# Altium project ESP32_LoRa_Master_Project.PrjPcb
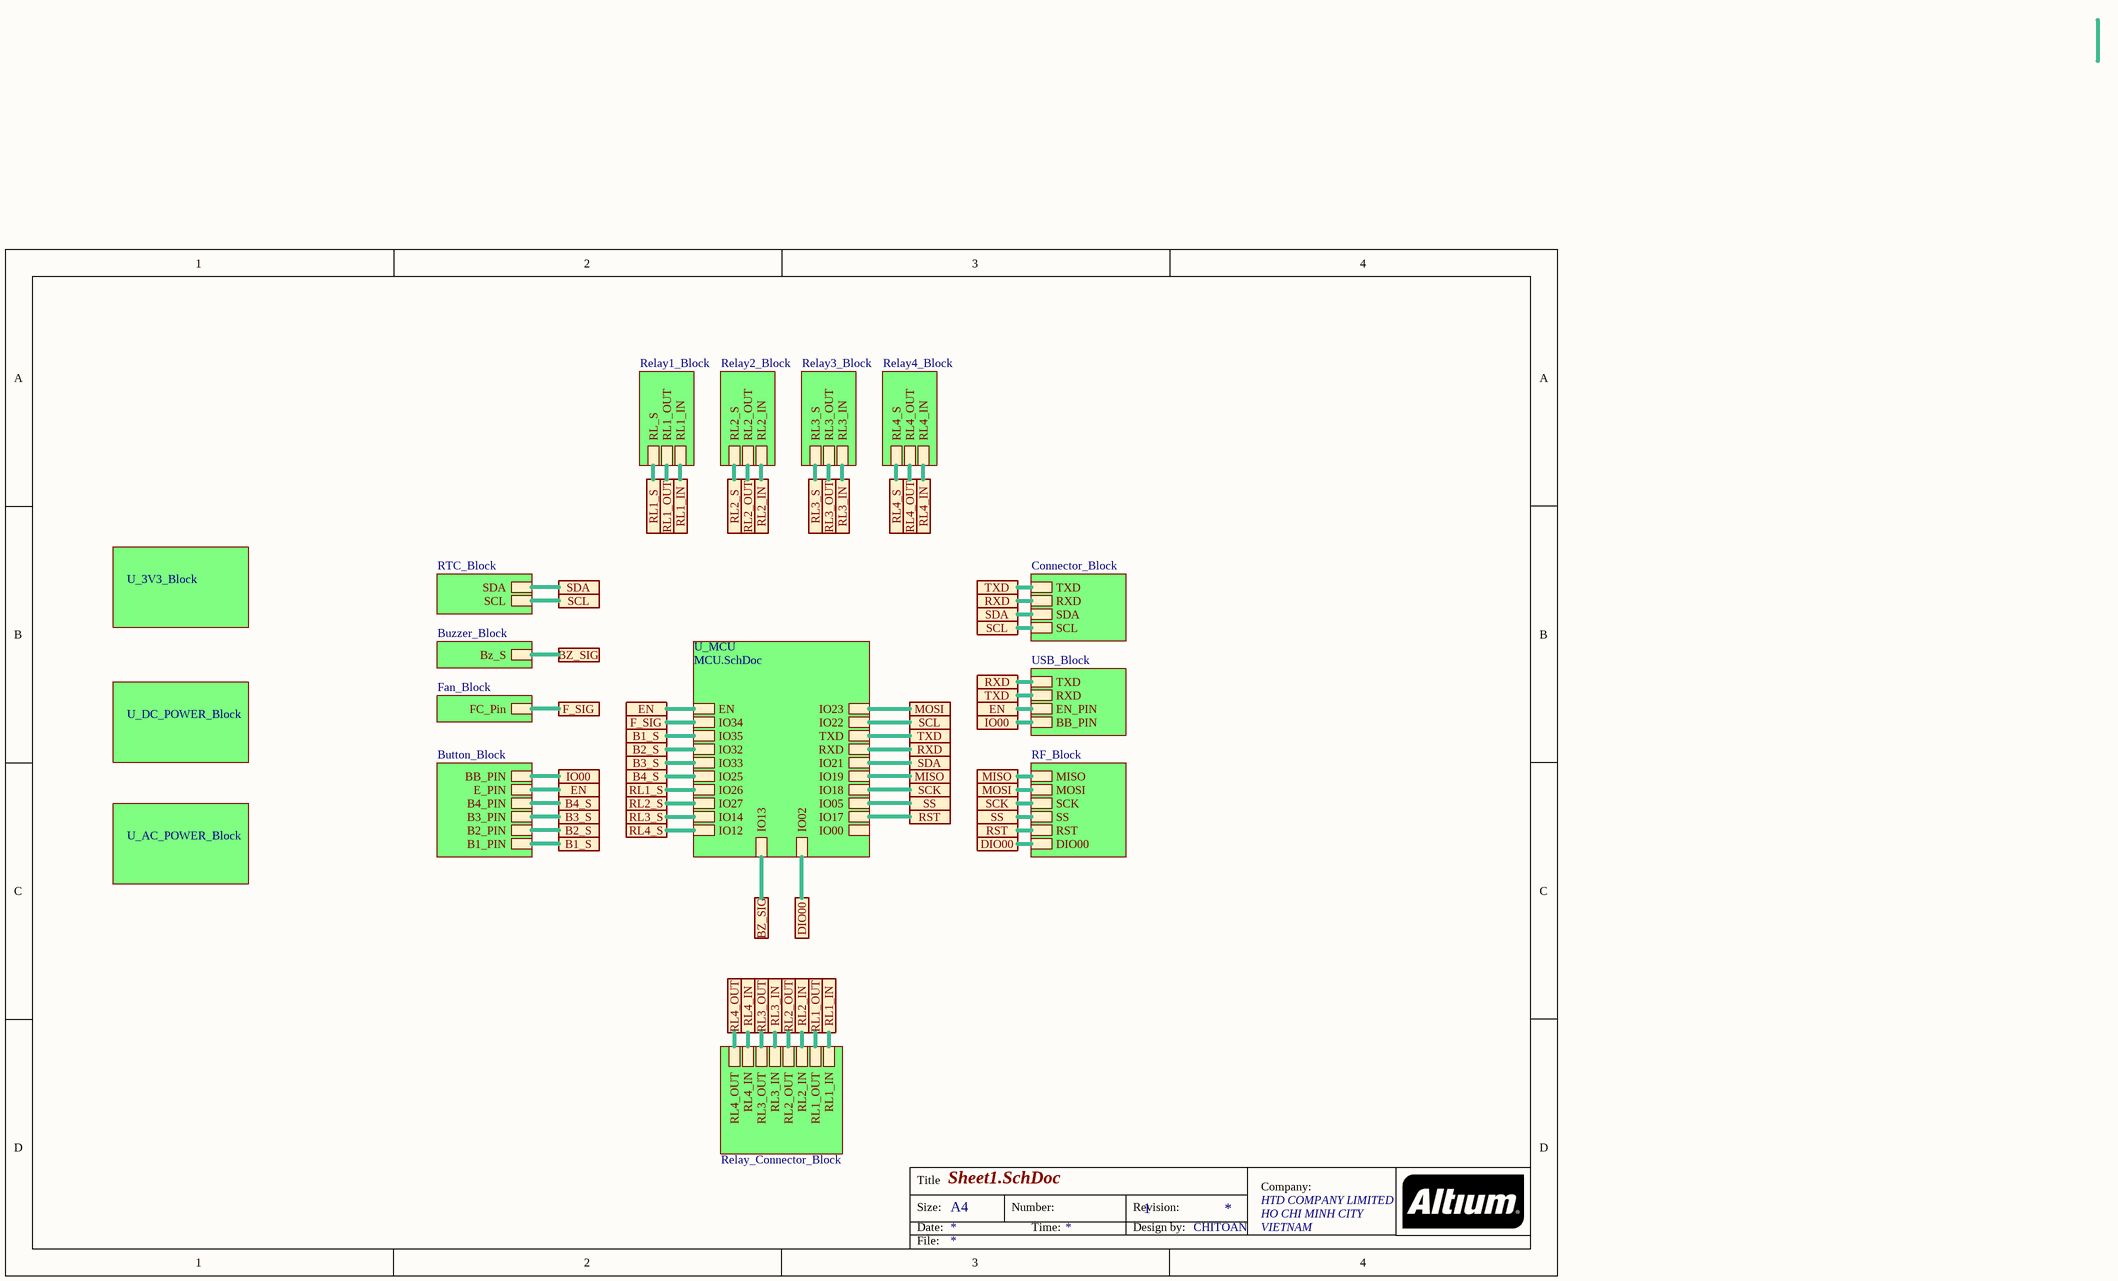
[diagram p0: Sheet1.SchDoc]
Company: HTD-Co.limit; Design By: CT-ENERGY; Version: V3
9 sheets, 68 parts. Net scope: hierarchical (ports join the sheet entries above them; power ports are global).
Board file: PCB2.PcbDoc
Sheets:
  Sheet1.SchDoc
    Relay1_Block = Relay1_Block.SchDoc
    Buzzer_Block = Buzzer_Block.SchDoc
    RTC_Block = RTC_Block.SchDoc
    USB_Block = USB_Block.SchDoc
    Connector_Block = Connector_Block.SchDoc
    U_DC_POWER_Block = DC_POWER_Block.SchDoc
    U_3V3_Block = 3V3_Block.SchDoc
    Button_Block = Button_Block.SchDoc

## Sheet Sheet1.SchDoc
size A4; ENG_APP_DATE: --/--/--; DSN_APP_DATE: --/--/--; CHK_APP_DATE: --/--/--; CheckedBy: CT-Energys; Author: CT-Energys; CompanyName: HTD COMPANY LIMITED; DrawnBy: CHITOAN; Engineer: CHITOAN; Organization: Altium Limited; Address1: HO CHI MINH CITY; Address2: VIETNAM; SheetNumber: 1; SheetTotal: 18

### Sub-sheets
Button_Block = Button_Block.SchDoc: B1_PIN, B2_PIN, B3_PIN, E_PIN, BB_PIN, B4_PIN
Buzzer_Block = Buzzer_Block.SchDoc: Bz_S
Connector_Block = Connector_Block.SchDoc: TXD, RXD, SDA, SCL
Fan_Block = Fan_Block.SchDoc (file not in this document): FC_Pin
Relay1_Block = Relay1_Block.SchDoc: RL_S, RL1_OUT, RL1_IN
Relay2_Block = Relay2_Block.SchDoc (file not in this document): RL2_S, RL2_OUT, RL2_IN
Relay3_Block = Relay3_Block.SchDoc (file not in this document): RL3_S, RL3_OUT, RL3_IN
Relay4_Block = Relay4_Block.SchDoc (file not in this document): RL4_S, RL4_OUT, RL4_IN
Relay_Connector_Block = Relay_Connector_Block.SchDoc (file not in this document): RL1_IN, RL1_OUT, RL2_IN, RL2_OUT, RL3_IN, RL3_OUT, RL4_IN, RL4_OUT
RF_Block = RF_Block.SchDoc (file not in this document): MISO, MOSI, SCK, SS, RST, DIO00
RTC_Block = RTC_Block.SchDoc: SCL, SDA
U_3V3_Block = 3V3_Block.SchDoc: no entries
U_AC_POWER_Block = AC_POWER_Block.SchDoc (file not in this document): no entries
U_DC_POWER_Block = DC_POWER_Block.SchDoc: no entries
U_MCU = MCU.SchDoc (file not in this document): EN, IO32, IO33, IO25, IO26, IO27, IO14, IO12, IO02, IO23, IO22, TXD, RXD, IO21, IO19, IO18, IO05, IO17, IO00, IO35, IO34, IO13
USB_Block = USB_Block.SchDoc: TXD, RXD, EN_PIN, BB_PIN

### Ports
B1_S, B2_S, B3_S, B4_S, BZ_SIG, DIO00, EN, F_SIG, IO00, MISO, MOSI, RL1_IN, RL1_OUT, RL1_S, RL2_IN, RL2_OUT, RL2_S, RL3_IN, RL3_OUT, RL3_S, RL4_IN, RL4_OUT, RL4_S, RST, RXD, SCK, SCL, SDA, SS, TXD

### Nets
NetC15_1: port IO00, sheet USB_Block/BB_PIN, sheet Button_Block/BB_PIN
NetC16_1: port EN, sheet USB_Block/EN_PIN, sheet Button_Block/E_PIN, sheet U_MCU/EN
NetH1_1: port B1_S, sheet Button_Block/B1_PIN, sheet U_MCU/IO35
NetH1_2: port B2_S, sheet Button_Block/B2_PIN, sheet U_MCU/IO32
NetH1_3: port B3_S, sheet Button_Block/B3_PIN, sheet U_MCU/IO33
NetH1_4: port B4_S, sheet Button_Block/B4_PIN, sheet U_MCU/IO25
NetH5_2: port TXD, sheet USB_Block/RXD, sheet Connector_Block/TXD, sheet U_MCU/TXD
NetH5_3: port RXD, sheet USB_Block/TXD, sheet Connector_Block/RXD, sheet U_MCU/RXD
NetH6_1: port SDA, sheet RTC_Block/SDA, sheet Connector_Block/SDA, sheet U_MCU/IO21
NetH6_2: port SCL, sheet RTC_Block/SCL, sheet Connector_Block/SCL, sheet U_MCU/IO22
NetR1_1: port RL1_S, sheet Relay1_Block/RL_S, sheet U_MCU/IO26
NetR18_2: port BZ_SIG, sheet Buzzer_Block/Bz_S, sheet U_MCU/IO13
NetRL1_3: port RL1_IN, sheet Relay1_Block/RL1_IN, sheet Relay_Connector_Block/RL1_IN
NetRL1_4: port RL1_OUT, sheet Relay1_Block/RL1_OUT, sheet Relay_Connector_Block/RL1_OUT
(unnamed): port MISO, sheet RF_Block/MISO, sheet U_MCU/IO19
(unnamed): port MOSI, sheet RF_Block/MOSI, sheet U_MCU/IO23
(unnamed): port SCK, sheet RF_Block/SCK, sheet U_MCU/IO18
(unnamed): port SS, sheet RF_Block/SS, sheet U_MCU/IO05
(unnamed): port RST, sheet RF_Block/RST, sheet U_MCU/IO17
(unnamed): port DIO00, sheet RF_Block/DIO00, sheet U_MCU/IO02
(unnamed): port F_SIG, sheet Fan_Block/FC_Pin, sheet U_MCU/IO34
(unnamed): port RL2_S, sheet Relay2_Block/RL2_S, sheet U_MCU/IO27
(unnamed): port RL2_OUT, sheet Relay2_Block/RL2_OUT, sheet Relay_Connector_Block/RL2_OUT
(unnamed): port RL2_IN, sheet Relay2_Block/RL2_IN, sheet Relay_Connector_Block/RL2_IN
(unnamed): port RL3_S, sheet Relay3_Block/RL3_S, sheet U_MCU/IO14
(unnamed): port RL3_OUT, sheet Relay3_Block/RL3_OUT, sheet Relay_Connector_Block/RL3_OUT
(unnamed): port RL3_IN, sheet Relay3_Block/RL3_IN, sheet Relay_Connector_Block/RL3_IN
(unnamed): port RL4_S, sheet Relay4_Block/RL4_S, sheet U_MCU/IO12
(unnamed): port RL4_OUT, sheet Relay4_Block/RL4_OUT, sheet Relay_Connector_Block/RL4_OUT
(unnamed): port RL4_IN, sheet Relay4_Block/RL4_IN, sheet Relay_Connector_Block/RL4_IN

### Notes on the sheet
- Title
- Size:
- Date:
- A4
- Number:
- Time:
- Revision:
- Design by:
- Company:
- File:

## Sheet Relay1_Block.SchDoc
size A4; CheckedBy: CT-Energys; Author: CT-Energys; CompanyName: HTD COMPANY LIMITED; DrawnBy: CHITOAN; Engineer: CHITOAN; Organization: Altium Limited; Address1: HO CHI MINH CITY; Address2: VIETNAM
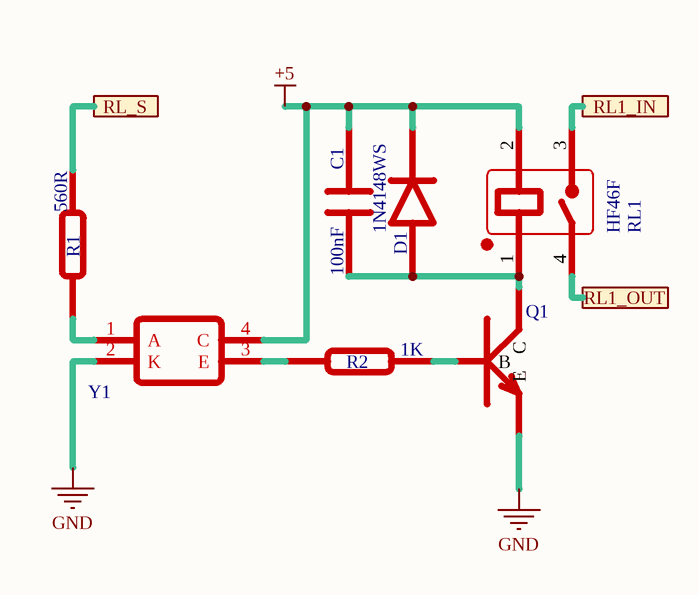
[diagram p1: Relay1_Block.SchDoc]

### Parts
C1  100nF  [C0805]
D1  1N4148WS  [SMA]
Q1  S8050  [SOT-23]  (value not drawn)
R1  560R  [R0603]
R2  1K  [R0603]
RL1  HF46F  [HF-46-X]
Y1  PHOTOCOUPLER  [SOP-4]  (value not drawn)

### Ports
RL1_IN, RL1_OUT, RL_S

### Nets
+5: C1.2 D1.K RL1.2 Y1.4(C)
GND: Q1.2(E) Y1.2(K)
NetC1_1: C1.1 D1.A Q1.3(C) RL1.1
NetQ1_1: Q1.1(B) R2.1
NetR1_1: R1.1 ; port RL_S
NetR1_2: R1.2 Y1.1(A)
NetR2_2: R2.2 Y1.3(E)
NetRL1_3: RL1.3 ; port RL1_IN
NetRL1_4: RL1.4 ; port RL1_OUT

### Notes on the sheet
- Title
- Size:
- Date:
- A4
- Number:
- Time:
- Revision:
- Design by:
- Company:
- File:

### Library data of the parts
C1 = CAP-CER: Ceramic Capacitor
D1 = 1N4148WS: Small Signal Diode
Q1 = S8050: NPN Transistors 0.5A Collector to Emitter 25V
R1 R2 = Resistor
RL1 = HF46F: Relay 4 Pin; ComponentLink1Description: HF-46F; ComponentLink1URL: https://source.hongfa.com/pdf/web/viewer.html?file=/Uploads/Product/PDF/HF46F_en.pdf
Y1 = PC817: Photo-Coupler; ComponentLink1Description: PC817; ComponentLink1URL: https://www.socle-tech.com/doc/IC%20Channel%20Product/Optoelectronic%20Components/Photocoupler/PC8171_NIP1B_ED-16P023.pdf

## Sheet Buzzer_Block.SchDoc
size A4; CheckedBy: CT-Energys; Author: CT-Energys; CompanyName: HTD COMPANY LIMITED; DrawnBy: CHITOAN; Engineer: CHITOAN; Organization: Altium Limited; Address1: HO CHI MINH CITY; Address2: VIETNAM
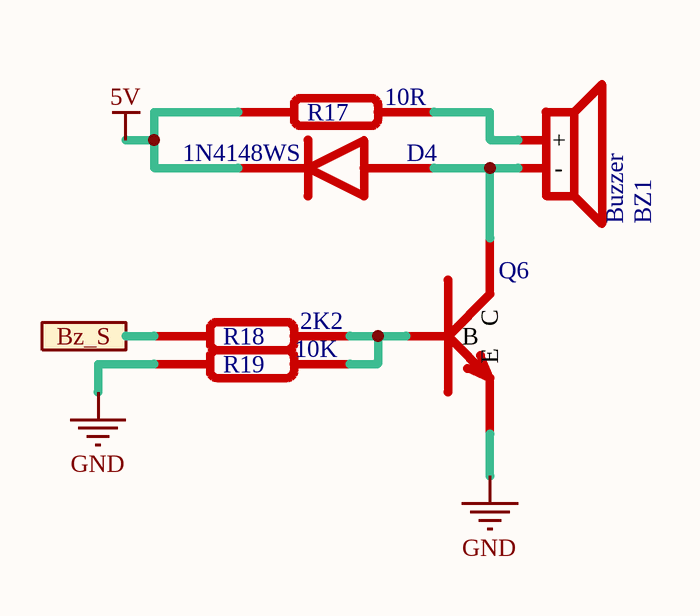
[diagram p2: Buzzer_Block.SchDoc]

### Parts
BZ1  Buzzer  [AST0927MW-03TRQ]
D4  1N4148WS  [SMA]
Q6  S8050  [SOT-23]  (value not drawn)
R17  10R  [R0603]
R18  2K2  [R0603]
R19  10K  [R0603]

### Ports
Bz_S

### Nets
5V: D4.K R17.2
GND: Q6.2(E) R19.2
NetBZ1_1: BZ1.1(+) R17.1
NetBZ1_2: BZ1.2(-) D4.A Q6.3(C)
NetQ6_1: Q6.1(B) R18.1 R19.1
NetR18_2: R18.2 ; port Bz_S

### Notes on the sheet
- Title
- Size:
- Date:
- A4
- Number:
- Time:
- Revision:
- Design by:
- Company:
- File:

### Library data of the parts
BZ1 = Buzzer: Voltage Rate 5V, Current 50mA
D4 = 1N4148WS: Small Signal Diode
Q6 = S8050: as Q1 on sheet Relay1_Block
R17-R19 = Resistor

## Sheet RTC_Block.SchDoc
size A4; CheckedBy: CT-Energys; Author: CT-Energys; CompanyName: HTD COMPANY LIMITED; DrawnBy: CHITOAN; Engineer: CHITOAN; Organization: Altium Limited; Address1: HO CHI MINH CITY; Address2: VIETNAM
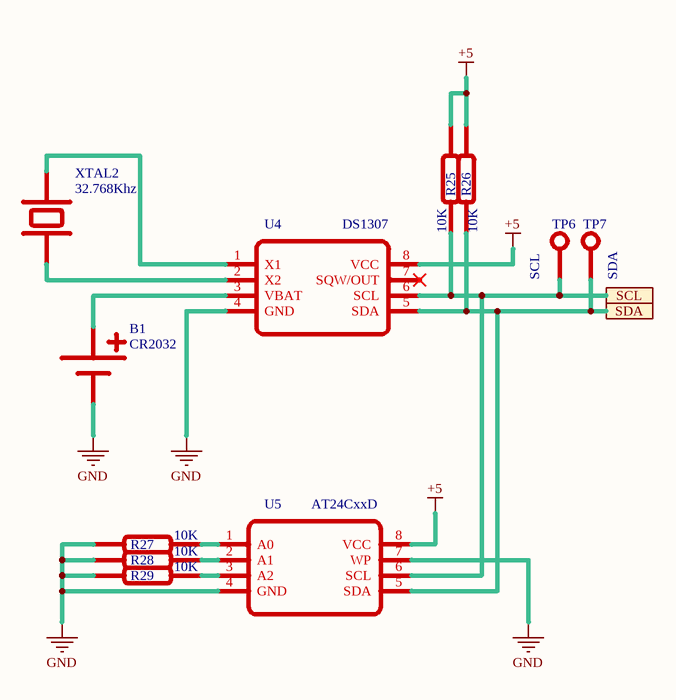
[diagram p3: RTC_Block.SchDoc]

### Parts
B1  CR2032  [CR2032-SMD-Thick]
R25  10K  [R0603]
R26  10K  [R0603]
R27  10K  [R0603]
R28  10K  [R0603]
R29  10K  [R0603]
TP6  SCL  [Test Point]
TP7  SDA  [Test Point]
U4  DS1307  [SOIC8]
U5  AT24CxxD  [SOIC8]
XTAL2  32.768Khz  [CRYSTAL DT38]

### Ports
SCL, SDA

### Nets
+5: R25.2 R26.2 U4.8(VCC) U5.8(VCC)
GND: B1.2 R27.1 R28.1 R29.1 U4.4(GND) U5.4(GND) U5.7(WP)
NetB1_1: B1.1 U4.3(VBAT)
NetH6_1: R26.1 TP7.1 U4.5(SDA) U5.5(SDA) ; port SDA
NetH6_2: R25.1 TP6.1 U4.6(SCL) U5.6(SCL) ; port SCL
NetR27_2: R27.2 U5.1(A0)
NetR28_2: R28.2 U5.2(A1)
NetR29_2: R29.2 U5.3(A2)
NetU4_1: U4.1(X1) XTAL2.1
NetU4_2: U4.2(X2) XTAL2.2

Not connected (* = marked no-connect by the designer): U4 7(SQW/OUT)*

### Notes on the sheet
- Title
- Size:
- Date:
- A4
- Number:
- Time:
- Revision:
- Design by:
- Company:
- File:

### Library data of the parts
B1 = CR2032: CR2032 Battery; ComponentLink1Description: CR2032 Battery; ComponentLink1URL: https://www.jauch.com/downloadfile/5ef1edcfd15cf1c9921d36c851eb4c34f/cr2032_jauch.pdf%C2%A0
R25-R29 = Resistor
TP6 TP7 = TestPoint: Test Point
U4 = DS1307: Realtime Clock IC; ComponentLink1Description: DS1307; ComponentLink1URL: https://www.alldatasheet.com/datasheet-pdf/view/254791/MAXIM/DS1307.html
U5 = AT24CxxD: I2C Serial EEPROM; ComponentLink1Description: AT24CS02; ComponentLink1URL: https://ww1.microchip.com/downloads/aemDocuments/documents/MPD/ProductDocuments/DataSheets/20006330A.pdf
XTAL2 = CRYSTAL-2P: Crystall 2Pin Capacitor Intergrated

## Sheet USB_Block.SchDoc
size A4; CheckedBy: CT-Energys; Author: CT-Energys; CompanyName: HTD COMPANY LIMITED; DrawnBy: CHITOAN; Engineer: CHITOAN; Organization: Altium Limited; Address1: HO CHI MINH CITY; Address2: VIETNAM
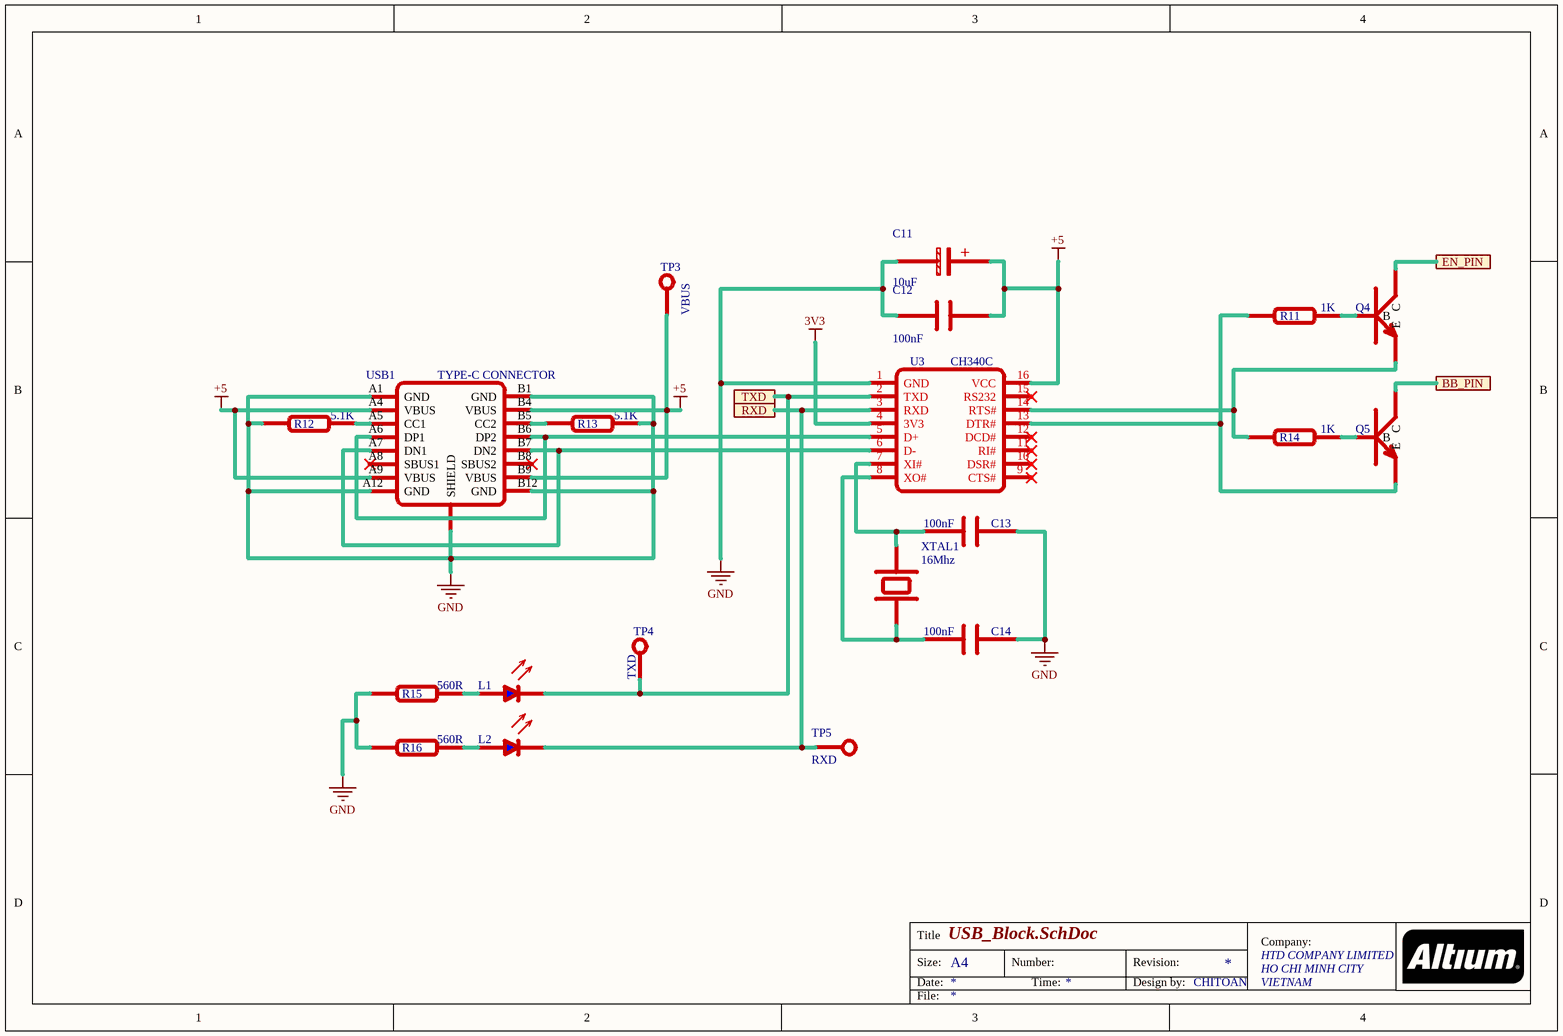
[diagram p4: USB_Block.SchDoc]

### Parts
C11  10uF  [CAP-AL-4x5.4]
C12  100nF  [C0805]
C13  100nF  [C0805]
C14  100nF  [C0805]
L1  LED-BLUE  [LED-0603-BLUE]  (value not drawn)
L2  LED-BLUE  [LED-0603-BLUE]  (value not drawn)
Q4  S8050  [SOT-23]  (value not drawn)
Q5  S8050  [SOT-23]  (value not drawn)
R11  1K  [R0603]
R12  5.1K  [R0603]
R13  5.1K  [R0603]
R14  1K  [R0603]
R15  560R  [R0603]
R16  560R  [R0603]
TP3  VBUS  [Test Point]
TP4  TXD  [Test Point]
TP5  RXD  [Test Point]
U3  CH340C  [SOP-16]
USB1  TYPE-C CONNECTOR  [USB-C-H-K-16P]
XTAL1  16Mhz  [Crystal 5032]

### Ports
BB_PIN, EN_PIN, RXD, TXD

### Nets
3V3: U3.4(3V3)
+5: C11.1 C12.2 TP3.1 U3.16(VCC) USB1.A4(VBUS) USB1.A9(VBUS) USB1.B4(VBUS) USB1.B9(VBUS)
GND: C11.2 C12.1 C13.1 C14.1 R12.2 R13.1 R15.1 R16.1 U3.1(GND) USB1.0(SHIELD) USB1.A1(GND) USB1.A12(GND) USB1.B1(GND) USB1.B12(GND)
NetC13_2: C13.2 U3.7(XI#) XTAL1.1
NetC14_2: C14.2 U3.8(XO#) XTAL1.3
NetC15_1: Q5.3(C) ; port BB_PIN
NetC16_1: Q4.3(C) ; port EN_PIN
NetH5_2: L2.2(K) TP5.1 U3.3(RXD) ; port RXD
NetH5_3: L1.2(K) TP4.1 U3.2(TXD) ; port TXD
NetL1_1: L1.1(A) R15.2
NetL2_1: L2.1(A) R16.2
NetQ4_1: Q4.1(B) R11.2
NetQ4_2: Q4.2(E) R14.1 U3.14(RTS#)
NetQ5_1: Q5.1(B) R14.2
NetQ5_2: Q5.2(E) R11.1 U3.13(DTR#)
NetR12_1: R12.1 USB1.A5(CC1)
NetR13_2: R13.2 USB1.B5(CC2)
NetU3_5: U3.5(D+) USB1.A6(DP1) USB1.B6(DP2)
NetU3_6: U3.6(D-) USB1.A7(DN1) USB1.B7(DN2)

Not connected (* = marked no-connect by the designer): U3 9(CTS#)* 10(DSR#)* 11(RI#)* 12(DCD#)* 15(RS232)*; USB1 A8(SBUS1)* B8(SBUS2)*; XTAL1 2 4

### Notes on the sheet
- Title
- Size:
- Date:
- A4
- Number:
- Time:
- Revision:
- Design by:
- Company:
- File:
- (in symbol CAP-ALU) +

### Library data of the parts
C11 = CAP-ALU: Aluminum Capacitor
C12-C14 = CAP-CER: Ceramic Capacitor
L1 L2 = LED-Blue: Blue Light Emiter Diode
Q4 Q5 = S8050: as Q1 on sheet Relay1_Block
R11-R16 = Resistor
TP3-TP5 = TestPoint: Test Point
U3 = CH340-16P: USB to UART bridge / CH340-G-C-B; ComponentLink1Description: CH340 Series; ComponentLink1URL: https://cdn.sparkfun.com/datasheets/Dev/Arduino/Other/CH340DS1.PDF
USB1 = USB-C-F-16P: 16P USB TYPE-C CONNECTOR
XTAL1 = CRYSTAL-4P: Crystall 3Pin Capacitor Intergrated

## Sheet Connector_Block.SchDoc
size A4; CheckedBy: CT-Energys; Author: CT-Energys; CompanyName: HTD COMPANY LIMITED; DrawnBy: CHITOAN; Engineer: CHITOAN; Organization: Altium Limited; Address1: HO CHI MINH CITY; Address2: VIETNAM
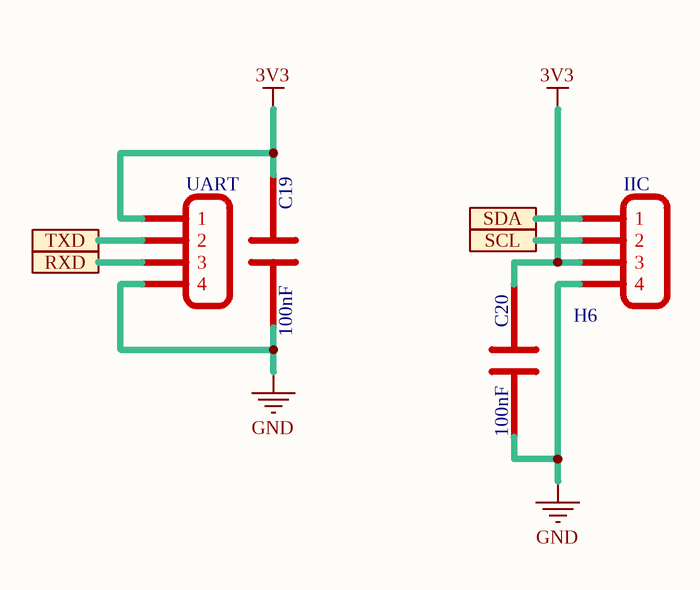
[diagram p5: Connector_Block.SchDoc]

### Parts
C19  100nF  [C0805]
C20  100nF  [C0805]
H5  UART  [XH-2.54-4P]
H6  IIC  [XH-2.54-4P]

### Ports
RXD, SCL, SDA, TXD

### Nets
3V3: C19.2 C20.2 H5.1 H6.3
GND: C19.1 C20.1 H5.4 H6.4
NetH5_2: H5.2 ; port TXD
NetH5_3: H5.3 ; port RXD
NetH6_1: H6.1 ; port SDA
NetH6_2: H6.2 ; port SCL

### Notes on the sheet
- Title
- Size:
- Date:
- A4
- Number:
- Time:
- Revision:
- Design by:
- Company:
- File:

### Library data of the parts
C19 C20 = CAP-CER: Ceramic Capacitor
H5 H6 = CONN-4P: Connector 4 Pole

## Sheet DC_POWER_Block.SchDoc
size A4; CheckedBy: CT-Energys; Author: CT-Energys; CompanyName: HTD COMPANY LIMITED; DrawnBy: CHITOAN; Engineer: CHITOAN; Organization: Altium Limited; Address1: HO CHI MINH CITY; Address2: VIETNAM
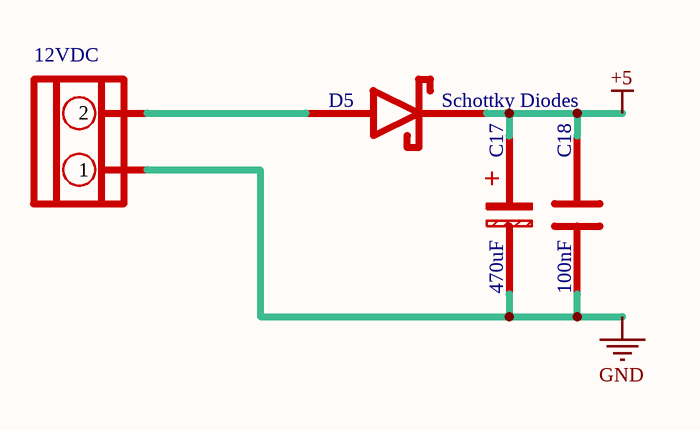
[diagram p6: DC_POWER_Block.SchDoc]

### Parts
C17  470uF  [CAP-AL-4x5.4]
C18  100nF  [C0805]
D5  Schottky Diodes  [SMA]
H3  12VDC  [KF301-2-V]

### Nets
+5: C17.1 C18.2 D5.K
GND: C17.2 C18.1 H3.1
NetD5_A: D5.A H3.2

### Notes on the sheet
- Title
- Size:
- Date:
- A4
- Number:
- Time:
- Revision:
- Design by:
- Company:
- File:
- (in symbol CAP-ALU) +

### Library data of the parts
C17 = CAP-ALU: Aluminum Capacitor
C18 = CAP-CER: Ceramic Capacitor
D5 = Diode_Schottky
H3 = KF301-2-V: Connector 5.08MM Pitch Vertical 2 Pole

## Sheet 3V3_Block.SchDoc
size A4; CheckedBy: CT-Energys; Author: CT-Energys; CompanyName: HTD COMPANY LIMITED; DrawnBy: CHITOAN; Engineer: CHITOAN; Organization: Altium Limited; Address1: HO CHI MINH CITY; Address2: VIETNAM
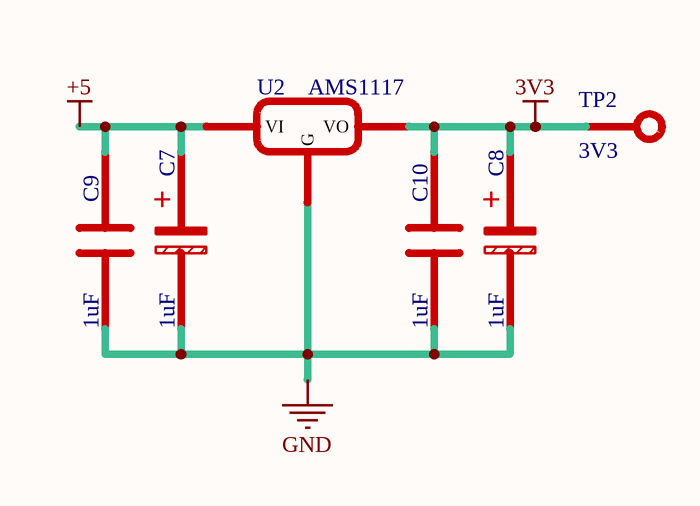
[diagram p7: 3V3_Block.SchDoc]

### Parts
C7  1uF  [CAP-AL-4x5.4]
C8  1uF  [CAP-AL-4x5.4]
C9  1uF  [C0805]
C10  1uF  [C0805]
TP2  3V3  [Test Point]
U2  AMS1117  [SOT-223]

### Nets
3V3: C8.1 C10.2 TP2.1 U2.2(VO)
+5: C7.1 C9.2 U2.3(VI)
GND: C7.2 C8.2 C9.1 C10.1 U2.1(G)

### Notes on the sheet
- Title
- Size:
- Date:
- A4
- Number:
- Time:
- Revision:
- Design by:
- Company:
- File:
- (in symbol CAP-ALU) +

### Library data of the parts
C7 C8 = CAP-ALU: Aluminum Capacitor
C9 C10 = CAP-CER: Ceramic Capacitor
TP2 = TestPoint: Test Point
U2 = AMS1117: Regulator intergated chip; pin to pad: 4>2; ComponentLink1Description: AMS1117-3.3; ComponentLink1URL: https://mm.digikey.com/Volume0/opasdata/d220001/medias/docus/6283/AMS1117-2.5.pdf

## Sheet Button_Block.SchDoc
size A4; CheckedBy: CT-Energys; Author: CT-Energys; CompanyName: HTD COMPANY LIMITED; DrawnBy: CHITOAN; Engineer: CHITOAN; Organization: Altium Limited; Address1: HO CHI MINH CITY; Address2: VIETNAM
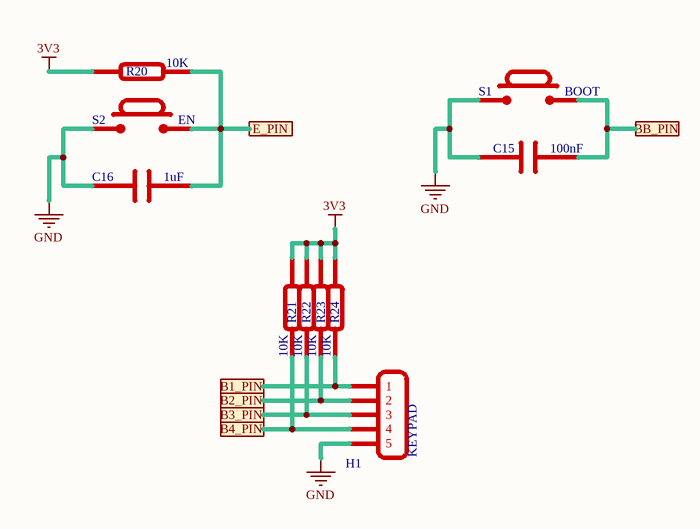
[diagram p8: Button_Block.SchDoc]

### Parts
C15  100nF  [C0603]
C16  1uF  [C0603]
H1  KEYPAD  [XH-2.54-5P]
R20  10K  [R0603]
R21  10K  [R0603]
R22  10K  [R0603]
R23  10K  [R0603]
R24  10K  [R0603]
S1  BOOT  [BTN-SMD-3x6]
S2  EN  [BTN-SMD-3x6]

### Ports
B1_PIN, B2_PIN, B3_PIN, B4_PIN, BB_PIN, E_PIN

### Nets
3V3: R20.2 R21.1 R22.1 R23.1 R24.1
GND: C15.2 C16.2 H1.5 S1.1 S2.1
NetC15_1: C15.1 S1.2 ; port BB_PIN
NetC16_1: C16.1 R20.1 S2.2 ; port E_PIN
NetH1_1: H1.1 R24.2 ; port B1_PIN
NetH1_2: H1.2 R23.2 ; port B2_PIN
NetH1_3: H1.3 R22.2 ; port B3_PIN
NetH1_4: H1.4 R21.2 ; port B4_PIN

### Notes on the sheet
- Title
- Size:
- Date:
- A4
- Number:
- Time:
- Revision:
- Design by:
- Company:
- File:

### Library data of the parts
C15 C16 = CAP-CER: Ceramic Capacitor
H1 = CONN-5P: Connector 5 Pole
R20-R24 = Resistor
S1 S2 = Button-2P: Tactile Switch 2 pole

## Nets that join several sheets
3V3: USB_Block (U3.4), Connector_Block (C19.2 C20.2 H5.1 H6.3), 3V3_Block (C8.1 C10.2 TP2.1 U2.2), Button_Block (5 pins)
+5: Relay1_Block (C1.2 D1.K RL1.2 Y1.4), RTC_Block (R25.2 R26.2 U4.8 U5.8), USB_Block (8 pins), DC_POWER_Block (C17.1 C18.2 D5.K), 3V3_Block (C7.1 C9.2 U2.3)
GND: Relay1_Block (Q1.2 Y1.2), Buzzer_Block (Q6.2 R19.2), RTC_Block (7 pins), USB_Block (14 pins), Connector_Block (C19.1 C20.1 H5.4 H6.4), DC_POWER_Block (C17.2 C18.1 H3.1), 3V3_Block (5 pins), Button_Block (5 pins)
NetC15_1: USB_Block (Q5.3), Button_Block (C15.1 S1.2)
NetC16_1: USB_Block (Q4.3), Button_Block (C16.1 R20.1 S2.2)
NetH5_2: USB_Block (L2.2 TP5.1 U3.3), Connector_Block (H5.2)
NetH5_3: USB_Block (L1.2 TP4.1 U3.2), Connector_Block (H5.3)
NetH6_1: RTC_Block (R26.1 TP7.1 U4.5 U5.5), Connector_Block (H6.1)
NetH6_2: RTC_Block (R25.1 TP6.1 U4.6 U5.6), Connector_Block (H6.2)